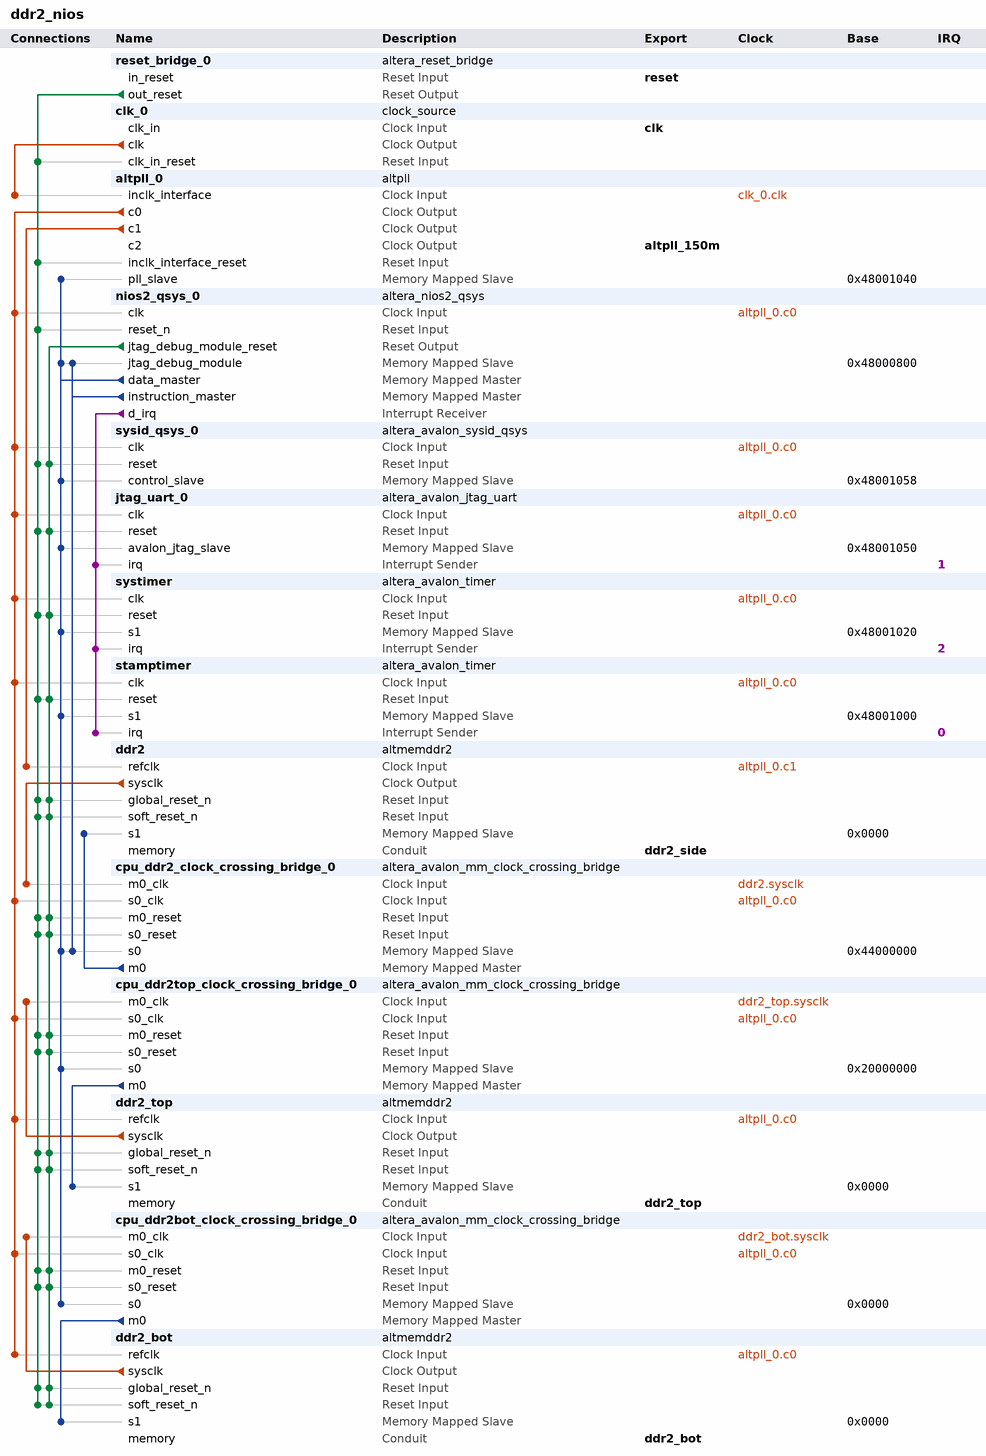
[diagram p0: system contents]
# Platform Designer (Qsys) system ddr2_nios, Cyclone IV E EP4CE115F29C8
# Parameters at their usual value, and those the tool derives, are not listed.
package require -exact qsys 13.0
create_system ddr2_nios
set_project_property DEVICE_FAMILY {Cyclone IV E}
set_project_property DEVICE EP4CE115F29C8

add_instance reset_bridge_0 altera_reset_bridge 13.0
set_instance_parameter_value reset_bridge_0 ACTIVE_LOW_RESET 1
set_instance_parameter_value reset_bridge_0 SYNCHRONOUS_EDGES none

add_instance clk_0 clock_source 13.0
set_instance_parameter_value clk_0 clockFrequency 50000000

add_instance altpll_0 altpll 13.0
set_instance_parameter_value altpll_0 INCLK0_INPUT_FREQUENCY 20000
set_instance_parameter_value altpll_0 CLK0_MULTIPLY_BY 2
set_instance_parameter_value altpll_0 CLK1_MULTIPLY_BY 8
set_instance_parameter_value altpll_0 CLK2_MULTIPLY_BY 3
set_instance_parameter_value altpll_0 CLK3_MULTIPLY_BY 1
set_instance_parameter_value altpll_0 CLK0_DIVIDE_BY 1
set_instance_parameter_value altpll_0 CLK1_DIVIDE_BY 5
set_instance_parameter_value altpll_0 CLK2_DIVIDE_BY 1
set_instance_parameter_value altpll_0 CLK3_DIVIDE_BY 1
set_instance_parameter_value altpll_0 CLK1_PHASE_SHIFT 0
set_instance_parameter_value altpll_0 CLK2_PHASE_SHIFT 0
set_instance_parameter_value altpll_0 CLK3_PHASE_SHIFT 0
set_instance_parameter_value altpll_0 CLK1_DUTY_CYCLE 50
set_instance_parameter_value altpll_0 CLK2_DUTY_CYCLE 50
set_instance_parameter_value altpll_0 CLK3_DUTY_CYCLE 50
set_instance_parameter_value altpll_0 PORT_clk1 PORT_USED
set_instance_parameter_value altpll_0 PORT_clk2 PORT_USED
set_instance_parameter_value altpll_0 PORT_clk3 PORT_USED
set_instance_parameter_value altpll_0 PORT_ARESET PORT_UNUSED
set_instance_parameter_value altpll_0 PORT_LOCKED PORT_UNUSED

add_instance nios2_qsys_0 altera_nios2_qsys 13.0
set_instance_parameter_value nios2_qsys_0 resetSlave ddr2.s1
set_instance_parameter_value nios2_qsys_0 mmu_TLBMissExcSlave None
set_instance_parameter_value nios2_qsys_0 exceptionSlave ddr2.s1
set_instance_parameter_value nios2_qsys_0 breakSlave nios2_qsys_0.jtag_debug_module
set_instance_parameter_value nios2_qsys_0 impl Fast
set_instance_parameter_value nios2_qsys_0 icache_size 8192
set_instance_parameter_value nios2_qsys_0 dcache_size 8192

add_instance sysid_qsys_0 altera_avalon_sysid_qsys 13.0
set_instance_parameter_value sysid_qsys_0 id 0

add_instance jtag_uart_0 altera_avalon_jtag_uart 13.0.1.99.2
set_instance_parameter_value jtag_uart_0 readBufferDepth 512
set_instance_parameter_value jtag_uart_0 simInteractiveOptions NO_INTERACTIVE_WINDOWS
set_instance_parameter_value jtag_uart_0 writeBufferDepth 512

add_instance systimer altera_avalon_timer 13.0.1.99.2
set_instance_parameter_value systimer period 10
set_instance_parameter_value systimer periodUnits MSEC

add_instance stamptimer altera_avalon_timer 13.0.1.99.2
set_instance_parameter_value stamptimer period 10
set_instance_parameter_value stamptimer periodUnits USEC

add_instance ddr2 altmemddr2 13.0
set_instance_parameter_value ddr2 pipeline_commands true
set_instance_parameter_value ddr2 debug_en false
set_instance_parameter_value ddr2 export_debug_port false
set_instance_parameter_value ddr2 use_generated_memory_model true
set_instance_parameter_value ddr2 dedicated_memory_clk_phase_label {Dedicated memory clock phase:}
set_instance_parameter_value ddr2 mem_if_clk_mhz 125.0
set_instance_parameter_value ddr2 quartus_project_exists false
set_instance_parameter_value ddr2 local_if_drate Full
set_instance_parameter_value ddr2 enable_v72_rsu false
set_instance_parameter_value ddr2 local_if_clk_mhz_label 125.0
set_instance_parameter_value ddr2 new_variant true
set_instance_parameter_value ddr2 mem_if_memtype {DDR2 SDRAM}
set_instance_parameter_value ddr2 pll_ref_clk_mhz 80.0
set_instance_parameter_value ddr2 mem_if_clk_ps_label {(8000 ps)}
set_instance_parameter_value ddr2 family {Cyclone IV E}
set_instance_parameter_value ddr2 project_family {Cyclone IV E}
set_instance_parameter_value ddr2 speed_grade 8
set_instance_parameter_value ddr2 dedicated_memory_clk_phase 0
set_instance_parameter_value ddr2 pll_ref_clk_ps_label {(12500 ps)}
set_instance_parameter_value ddr2 avalon_burst_length 1
set_instance_parameter_value ddr2 mem_if_clk_pair_count 1
set_instance_parameter_value ddr2 mem_if_cs_per_dimm 1
set_instance_parameter_value ddr2 pre_latency_label {Fix read latency at:}
set_instance_parameter_value ddr2 dedicated_memory_clk_en false
set_instance_parameter_value ddr2 mirror_addressing 0
set_instance_parameter_value ddr2 mem_if_bankaddr_width 2
set_instance_parameter_value ddr2 register_control_word_9 0000
set_instance_parameter_value ddr2 mem_if_rowaddr_width 13
set_instance_parameter_value ddr2 mem_dyn_deskew_en false
set_instance_parameter_value ddr2 post_latency_label {cycles (0 cycles=minimum latency, non-deterministic)}
set_instance_parameter_value ddr2 mem_if_dm_pins_en Yes
set_instance_parameter_value ddr2 local_if_dwidth_label 32
set_instance_parameter_value ddr2 register_control_word_7 0000
set_instance_parameter_value ddr2 register_control_word_8 0000
set_instance_parameter_value ddr2 mem_if_preset {Custom (Samsung K4T51163QB-GCCC)}
set_instance_parameter_value ddr2 mem_if_pchaddr_bit 10
set_instance_parameter_value ddr2 WIDTH_RATIO 4
set_instance_parameter_value ddr2 vendor Samsung
set_instance_parameter_value ddr2 register_control_word_3 0000
set_instance_parameter_value ddr2 register_control_word_4 0000
set_instance_parameter_value ddr2 chip_or_dimm {Discrete Device}
set_instance_parameter_value ddr2 register_control_word_5 0000
set_instance_parameter_value ddr2 register_control_word_6 0000
set_instance_parameter_value ddr2 mem_fmax 200.0
set_instance_parameter_value ddr2 register_control_word_0 0000
set_instance_parameter_value ddr2 register_control_word_size 4
set_instance_parameter_value ddr2 register_control_word_1 0000
set_instance_parameter_value ddr2 register_control_word_2 0000
set_instance_parameter_value ddr2 register_control_word_11 0000
set_instance_parameter_value ddr2 register_control_word_10 0000
set_instance_parameter_value ddr2 mem_if_cs_width 1
set_instance_parameter_value ddr2 mem_if_preset_rlat 0
set_instance_parameter_value ddr2 mem_if_cs_per_rank 1
set_instance_parameter_value ddr2 fast_simulation_en FAST
set_instance_parameter_value ddr2 register_control_word_15 0000
set_instance_parameter_value ddr2 register_control_word_14 0000
set_instance_parameter_value ddr2 mem_if_dwidth 16
set_instance_parameter_value ddr2 mem_if_dq_per_dqs 8
set_instance_parameter_value ddr2 mem_if_coladdr_width 10
set_instance_parameter_value ddr2 register_control_word_13 0000
set_instance_parameter_value ddr2 register_control_word_12 0000
set_instance_parameter_value ddr2 mem_tiha_ps 600
set_instance_parameter_value ddr2 mem_tdsh_ck 0.2
set_instance_parameter_value ddr2 mem_if_trfc_ns 105.0
set_instance_parameter_value ddr2 mem_tqh_ck 0.36
set_instance_parameter_value ddr2 mem_tisa_ps 600
set_instance_parameter_value ddr2 mem_tdss_ck 0.2
set_instance_parameter_value ddr2 mem_trtp_ns 8.8
set_instance_parameter_value ddr2 mem_if_tinit_us 200.0
set_instance_parameter_value ddr2 mem_if_trcd_ns 15.0
set_instance_parameter_value ddr2 mem_if_twtr_ck 2
set_instance_parameter_value ddr2 mem_trrd_ns 10.0
set_instance_parameter_value ddr2 mem_tdqss_ck 0.25
set_instance_parameter_value ddr2 mem_tqhs_ps 400
set_instance_parameter_value ddr2 mem_tdsa_ps 400
set_instance_parameter_value ddr2 mem_tac_ps 500
set_instance_parameter_value ddr2 mem_tdha_ps 400
set_instance_parameter_value ddr2 mem_if_tras_ns 45.0
set_instance_parameter_value ddr2 mem_if_twr_ns 15.0
set_instance_parameter_value ddr2 mem_tdqsck_ps 450
set_instance_parameter_value ddr2 mem_if_trp_ns 15.0
set_instance_parameter_value ddr2 mem_tdqsq_ps 300
set_instance_parameter_value ddr2 mem_if_tmrd_ns 7.0
set_instance_parameter_value ddr2 mem_tfaw_ns 50.0
set_instance_parameter_value ddr2 mem_if_trefi_us 7.0
set_instance_parameter_value ddr2 mem_tcl_40_fmax 200.0
set_instance_parameter_value ddr2 mem_odt 50
set_instance_parameter_value ddr2 mp_WLH_percent 0.6
set_instance_parameter_value ddr2 mem_drv_str Normal
set_instance_parameter_value ddr2 mp_DH_percent 0.5
set_instance_parameter_value ddr2 input_period 0
set_instance_parameter_value ddr2 mp_QH_percent 0.5
set_instance_parameter_value ddr2 mp_QHS_percent 0.5
set_instance_parameter_value ddr2 mem_tcl_30_fmax 200.0
set_instance_parameter_value ddr2 ac_clk_select 90
set_instance_parameter_value ddr2 mp_DQSQ_percent 0.65
set_instance_parameter_value ddr2 mp_DS_percent 0.6
set_instance_parameter_value ddr2 pll_reconfig_ports_en false
set_instance_parameter_value ddr2 mem_btype Sequential
set_instance_parameter_value ddr2 mp_IS_percent 0.7
set_instance_parameter_value ddr2 mem_tcl 3.0
set_instance_parameter_value ddr2 mp_DQSS_percent 0.5
set_instance_parameter_value ddr2 export_bank_info false
set_instance_parameter_value ddr2 mp_DSS_percent 0.6
set_instance_parameter_value ddr2 mem_dll_en Yes
set_instance_parameter_value ddr2 ac_phase 90
set_instance_parameter_value ddr2 mem_if_oct_en false
set_instance_parameter_value ddr2 mem_tcl_60_fmax 200.0
set_instance_parameter_value ddr2 mp_DSH_percent 0.6
set_instance_parameter_value ddr2 mem_if_dqsn_en false
set_instance_parameter_value ddr2 enable_mp_calibration true
set_instance_parameter_value ddr2 mp_IH_percent 0.6
set_instance_parameter_value ddr2 mem_tcl_15_fmax 533.0
set_instance_parameter_value ddr2 dll_external false
set_instance_parameter_value ddr2 mem_bl 4
set_instance_parameter_value ddr2 mp_WLS_percent 0.7
set_instance_parameter_value ddr2 mem_tcl_50_fmax 200.0
set_instance_parameter_value ddr2 mp_DQSCK_percent 0.5
set_instance_parameter_value ddr2 mem_tcl_25_fmax 533.0
set_instance_parameter_value ddr2 mem_tcl_20_fmax 533.0
set_instance_parameter_value ddr2 cfg_reorder_data true
set_instance_parameter_value ddr2 ctl_ecc_en false
set_instance_parameter_value ddr2 ctl_hrb_en false
set_instance_parameter_value ddr2 ref_clk_source altpll_0
set_instance_parameter_value ddr2 cfg_data_reordering_type INTER_BANK
set_instance_parameter_value ddr2 ctl_powerdn_en false
set_instance_parameter_value ddr2 multicast_wr_en false
set_instance_parameter_value ddr2 auto_powerdn_cycles 0
set_instance_parameter_value ddr2 ctl_self_refresh_en false
set_instance_parameter_value ddr2 cfg_starve_limit 10
set_instance_parameter_value ddr2 ctl_latency 0
set_instance_parameter_value ddr2 tool_context SOPC_BUILDER
set_instance_parameter_value ddr2 mem_addr_mapping CHIP_ROW_BANK_COL
set_instance_parameter_value ddr2 burst_merge_en false
set_instance_parameter_value ddr2 user_refresh_en false
set_instance_parameter_value ddr2 qsys_mode true
set_instance_parameter_value ddr2 clk_source_sharing_en false
set_instance_parameter_value ddr2 ctl_lookahead_depth 4
set_instance_parameter_value ddr2 ctl_autopch_en false
set_instance_parameter_value ddr2 ctl_dynamic_bank_allocation false
set_instance_parameter_value ddr2 ctl_dynamic_bank_num 4
set_instance_parameter_value ddr2 local_if_type_avalon true
set_instance_parameter_value ddr2 csr_en false
set_instance_parameter_value ddr2 ctl_auto_correct_en false
set_instance_parameter_value ddr2 auto_powerdn_en false
set_instance_parameter_value ddr2 phy_if_type_afi true
set_instance_parameter_value ddr2 controller_type ngv110_ctl
set_instance_parameter_value ddr2 max_local_size 4
set_instance_parameter_value ddr2 mem_srtr Normal
set_instance_parameter_value ddr2 mem_mpr_loc {Predefined Pattern}
set_instance_parameter_value ddr2 dss_tinit_rst_us 200.0
set_instance_parameter_value ddr2 mem_tcl_90_fmax 400.0
set_instance_parameter_value ddr2 mem_rtt_wr {Dynamic ODT off}
set_instance_parameter_value ddr2 mem_tcl_100_fmax 400.0
set_instance_parameter_value ddr2 mem_pasr {Full Array}
set_instance_parameter_value ddr2 mem_asrm {Manual SR Reference (SRT)}
set_instance_parameter_value ddr2 mem_mpr_oper {Predefined Pattern}
set_instance_parameter_value ddr2 mem_tcl_80_fmax 400.0
set_instance_parameter_value ddr2 mem_drv_impedance RZQ/7
set_instance_parameter_value ddr2 mem_rtt_nom {ODT Disabled}
set_instance_parameter_value ddr2 mem_tcl_70_fmax 400.0
set_instance_parameter_value ddr2 mem_wtcl 5.0
set_instance_parameter_value ddr2 mem_dll_pch {Fast Exit}
set_instance_parameter_value ddr2 mem_atcl Disabled
set_instance_parameter_value ddr2 board_settings_valid true
set_instance_parameter_value ddr2 t_IH 0.6
set_instance_parameter_value ddr2 board_intra_DQS_group_skew 0.02
set_instance_parameter_value ddr2 isi_DQS 0.0
set_instance_parameter_value ddr2 addr_cmd_slew_rate 1.0
set_instance_parameter_value ddr2 board_tpd_inter_DIMM 0.05
set_instance_parameter_value ddr2 board_addresscmd_CK_skew 0.0
set_instance_parameter_value ddr2 t_DS_calculated 0.400
set_instance_parameter_value ddr2 isi_addresscmd_hold 0.0
set_instance_parameter_value ddr2 t_IS 0.6
set_instance_parameter_value ddr2 restore_default_toggle false
set_instance_parameter_value ddr2 dqs_dqsn_slew_rate 2.0
set_instance_parameter_value ddr2 dq_slew_rate 1.0
set_instance_parameter_value ddr2 board_inter_DQS_group_skew 0.02
set_instance_parameter_value ddr2 isi_addresscmd_setup 0.0
set_instance_parameter_value ddr2 board_minCK_DQS_skew -0.01
set_instance_parameter_value ddr2 t_IS_calculated 0.600
set_instance_parameter_value ddr2 num_slots_or_devices 1
set_instance_parameter_value ddr2 board_maxCK_DQS_skew 0.01
set_instance_parameter_value ddr2 board_skew_ps 20
set_instance_parameter_value ddr2 t_DH 0.4
set_instance_parameter_value ddr2 ck_ckn_slew_rate 2.0
set_instance_parameter_value ddr2 isi_DQ 0.0
set_instance_parameter_value ddr2 t_IH_calculated 0.600
set_instance_parameter_value ddr2 t_DH_calculated 0.400
set_instance_parameter_value ddr2 t_DS 0.4

add_instance cpu_ddr2_clock_crossing_bridge_0 altera_avalon_mm_clock_crossing_bridge 13.0
set_instance_parameter_value cpu_ddr2_clock_crossing_bridge_0 DATA_WIDTH 32
set_instance_parameter_value cpu_ddr2_clock_crossing_bridge_0 ADDRESS_WIDTH 26
set_instance_parameter_value cpu_ddr2_clock_crossing_bridge_0 MAX_BURST_SIZE 2
set_instance_parameter_value cpu_ddr2_clock_crossing_bridge_0 COMMAND_FIFO_DEPTH 128
set_instance_parameter_value cpu_ddr2_clock_crossing_bridge_0 RESPONSE_FIFO_DEPTH 128
set_instance_parameter_value cpu_ddr2_clock_crossing_bridge_0 MASTER_SYNC_DEPTH 2
set_instance_parameter_value cpu_ddr2_clock_crossing_bridge_0 SLAVE_SYNC_DEPTH 2

add_instance cpu_ddr2top_clock_crossing_bridge_0 altera_avalon_mm_clock_crossing_bridge 13.0
set_instance_parameter_value cpu_ddr2top_clock_crossing_bridge_0 DATA_WIDTH 96
set_instance_parameter_value cpu_ddr2top_clock_crossing_bridge_0 ADDRESS_WIDTH 28
set_instance_parameter_value cpu_ddr2top_clock_crossing_bridge_0 MAX_BURST_SIZE 4
set_instance_parameter_value cpu_ddr2top_clock_crossing_bridge_0 COMMAND_FIFO_DEPTH 128
set_instance_parameter_value cpu_ddr2top_clock_crossing_bridge_0 RESPONSE_FIFO_DEPTH 128
set_instance_parameter_value cpu_ddr2top_clock_crossing_bridge_0 MASTER_SYNC_DEPTH 2
set_instance_parameter_value cpu_ddr2top_clock_crossing_bridge_0 SLAVE_SYNC_DEPTH 2

add_instance ddr2_top altmemddr2 13.0
set_instance_parameter_value ddr2_top pipeline_commands false
set_instance_parameter_value ddr2_top debug_en false
set_instance_parameter_value ddr2_top export_debug_port false
set_instance_parameter_value ddr2_top use_generated_memory_model true
set_instance_parameter_value ddr2_top dedicated_memory_clk_phase_label {Dedicated memory clock phase:}
set_instance_parameter_value ddr2_top mem_if_clk_mhz 150.0
set_instance_parameter_value ddr2_top quartus_project_exists false
set_instance_parameter_value ddr2_top local_if_drate Full
set_instance_parameter_value ddr2_top enable_v72_rsu false
set_instance_parameter_value ddr2_top local_if_clk_mhz_label 150.0
set_instance_parameter_value ddr2_top new_variant true
set_instance_parameter_value ddr2_top mem_if_memtype {DDR2 SDRAM}
set_instance_parameter_value ddr2_top pll_ref_clk_mhz 100.0
set_instance_parameter_value ddr2_top mem_if_clk_ps_label {(6667 ps)}
set_instance_parameter_value ddr2_top family {Cyclone IV E}
set_instance_parameter_value ddr2_top project_family {Cyclone IV E}
set_instance_parameter_value ddr2_top speed_grade 8
set_instance_parameter_value ddr2_top dedicated_memory_clk_phase 0
set_instance_parameter_value ddr2_top pll_ref_clk_ps_label {(10000 ps)}
set_instance_parameter_value ddr2_top avalon_burst_length 1
set_instance_parameter_value ddr2_top mem_if_clk_pair_count 2
set_instance_parameter_value ddr2_top mem_if_cs_per_dimm 1
set_instance_parameter_value ddr2_top pre_latency_label {Fix read latency at:}
set_instance_parameter_value ddr2_top dedicated_memory_clk_en false
set_instance_parameter_value ddr2_top mirror_addressing 0
set_instance_parameter_value ddr2_top mem_if_bankaddr_width 2
set_instance_parameter_value ddr2_top register_control_word_9 0000
set_instance_parameter_value ddr2_top mem_if_rowaddr_width 13
set_instance_parameter_value ddr2_top mem_dyn_deskew_en false
set_instance_parameter_value ddr2_top post_latency_label {cycles (0 cycles=minimum latency, non-deterministic)}
set_instance_parameter_value ddr2_top mem_if_dm_pins_en Yes
set_instance_parameter_value ddr2_top local_if_dwidth_label 96
set_instance_parameter_value ddr2_top register_control_word_7 0000
set_instance_parameter_value ddr2_top register_control_word_8 0000
set_instance_parameter_value ddr2_top mem_if_preset {Micron MT47H32M16CC-3}
set_instance_parameter_value ddr2_top mem_if_pchaddr_bit 10
set_instance_parameter_value ddr2_top WIDTH_RATIO 4
set_instance_parameter_value ddr2_top vendor Micron
set_instance_parameter_value ddr2_top register_control_word_3 0000
set_instance_parameter_value ddr2_top register_control_word_4 0000
set_instance_parameter_value ddr2_top chip_or_dimm {Discrete Device}
set_instance_parameter_value ddr2_top register_control_word_5 0000
set_instance_parameter_value ddr2_top register_control_word_6 0000
set_instance_parameter_value ddr2_top mem_fmax 333.333
set_instance_parameter_value ddr2_top register_control_word_0 0000
set_instance_parameter_value ddr2_top register_control_word_size 4
set_instance_parameter_value ddr2_top register_control_word_1 0000
set_instance_parameter_value ddr2_top register_control_word_2 0000
set_instance_parameter_value ddr2_top register_control_word_11 0000
set_instance_parameter_value ddr2_top register_control_word_10 0000
set_instance_parameter_value ddr2_top mem_if_cs_width 1
set_instance_parameter_value ddr2_top mem_if_preset_rlat 0
set_instance_parameter_value ddr2_top mem_if_cs_per_rank 1
set_instance_parameter_value ddr2_top fast_simulation_en FAST
set_instance_parameter_value ddr2_top register_control_word_15 0000
set_instance_parameter_value ddr2_top register_control_word_14 0000
set_instance_parameter_value ddr2_top mem_if_dwidth 48
set_instance_parameter_value ddr2_top mem_if_dq_per_dqs 8
set_instance_parameter_value ddr2_top mem_if_coladdr_width 10
set_instance_parameter_value ddr2_top register_control_word_13 0000
set_instance_parameter_value ddr2_top register_control_word_12 0000
set_instance_parameter_value ddr2_top mem_tiha_ps 400
set_instance_parameter_value ddr2_top mem_tdsh_ck 0.2
set_instance_parameter_value ddr2_top mem_if_trfc_ns 105.0
set_instance_parameter_value ddr2_top mem_tqh_ck 0.36
set_instance_parameter_value ddr2_top mem_tisa_ps 400
set_instance_parameter_value ddr2_top mem_tdss_ck 0.2
set_instance_parameter_value ddr2_top mem_trtp_ns 7.5
set_instance_parameter_value ddr2_top mem_if_tinit_us 200.0
set_instance_parameter_value ddr2_top mem_if_trcd_ns 15.0
set_instance_parameter_value ddr2_top mem_if_twtr_ck 3
set_instance_parameter_value ddr2_top mem_trrd_ns 10.0
set_instance_parameter_value ddr2_top mem_tdqss_ck 0.25
set_instance_parameter_value ddr2_top mem_tqhs_ps 340
set_instance_parameter_value ddr2_top mem_tdsa_ps 300
set_instance_parameter_value ddr2_top mem_tac_ps 450
set_instance_parameter_value ddr2_top mem_tdha_ps 300
set_instance_parameter_value ddr2_top mem_if_tras_ns 40.0
set_instance_parameter_value ddr2_top mem_if_twr_ns 15.0
set_instance_parameter_value ddr2_top mem_tdqsck_ps 400
set_instance_parameter_value ddr2_top mem_if_trp_ns 15.0
set_instance_parameter_value ddr2_top mem_tdqsq_ps 240
set_instance_parameter_value ddr2_top mem_if_tmrd_ns 6.0
set_instance_parameter_value ddr2_top mem_tfaw_ns 50.0
set_instance_parameter_value ddr2_top mem_if_trefi_us 7.8
set_instance_parameter_value ddr2_top mem_tcl_40_fmax 266.667
set_instance_parameter_value ddr2_top mem_odt 50
set_instance_parameter_value ddr2_top mp_WLH_percent 0.6
set_instance_parameter_value ddr2_top mem_drv_str Normal
set_instance_parameter_value ddr2_top mp_DH_percent 0.5
set_instance_parameter_value ddr2_top input_period 0
set_instance_parameter_value ddr2_top mp_QH_percent 0.5
set_instance_parameter_value ddr2_top mp_QHS_percent 0.5
set_instance_parameter_value ddr2_top mem_tcl_30_fmax 200.0
set_instance_parameter_value ddr2_top ac_clk_select 90
set_instance_parameter_value ddr2_top mp_DQSQ_percent 0.65
set_instance_parameter_value ddr2_top mp_DS_percent 0.6
set_instance_parameter_value ddr2_top pll_reconfig_ports_en false
set_instance_parameter_value ddr2_top mem_btype Sequential
set_instance_parameter_value ddr2_top mp_IS_percent 0.7
set_instance_parameter_value ddr2_top mem_tcl 5.0
set_instance_parameter_value ddr2_top mp_DQSS_percent 0.5
set_instance_parameter_value ddr2_top export_bank_info false
set_instance_parameter_value ddr2_top mp_DSS_percent 0.6
set_instance_parameter_value ddr2_top mem_dll_en Yes
set_instance_parameter_value ddr2_top ac_phase 90
set_instance_parameter_value ddr2_top mem_if_oct_en false
set_instance_parameter_value ddr2_top mem_tcl_60_fmax 333.333
set_instance_parameter_value ddr2_top mp_DSH_percent 0.6
set_instance_parameter_value ddr2_top mem_if_dqsn_en false
set_instance_parameter_value ddr2_top enable_mp_calibration true
set_instance_parameter_value ddr2_top mp_IH_percent 0.6
set_instance_parameter_value ddr2_top mem_tcl_15_fmax 533.0
set_instance_parameter_value ddr2_top dll_external false
set_instance_parameter_value ddr2_top mem_bl 4
set_instance_parameter_value ddr2_top mp_WLS_percent 0.7
set_instance_parameter_value ddr2_top mem_tcl_50_fmax 333.333
set_instance_parameter_value ddr2_top mp_DQSCK_percent 0.5
set_instance_parameter_value ddr2_top mem_tcl_25_fmax 533.0
set_instance_parameter_value ddr2_top mem_tcl_20_fmax 533.0
set_instance_parameter_value ddr2_top cfg_reorder_data true
set_instance_parameter_value ddr2_top ctl_ecc_en false
set_instance_parameter_value ddr2_top ctl_hrb_en false
set_instance_parameter_value ddr2_top ref_clk_source altpll_0
set_instance_parameter_value ddr2_top cfg_data_reordering_type INTER_BANK
set_instance_parameter_value ddr2_top ctl_powerdn_en false
set_instance_parameter_value ddr2_top multicast_wr_en false
set_instance_parameter_value ddr2_top auto_powerdn_cycles 0
set_instance_parameter_value ddr2_top ctl_self_refresh_en false
set_instance_parameter_value ddr2_top cfg_starve_limit 10
set_instance_parameter_value ddr2_top ctl_latency 0
set_instance_parameter_value ddr2_top tool_context SOPC_BUILDER
set_instance_parameter_value ddr2_top mem_addr_mapping CHIP_ROW_BANK_COL
set_instance_parameter_value ddr2_top burst_merge_en false
set_instance_parameter_value ddr2_top user_refresh_en false
set_instance_parameter_value ddr2_top qsys_mode true
set_instance_parameter_value ddr2_top clk_source_sharing_en false
set_instance_parameter_value ddr2_top ctl_lookahead_depth 4
set_instance_parameter_value ddr2_top ctl_autopch_en false
set_instance_parameter_value ddr2_top ctl_dynamic_bank_allocation false
set_instance_parameter_value ddr2_top ctl_dynamic_bank_num 4
set_instance_parameter_value ddr2_top local_if_type_avalon true
set_instance_parameter_value ddr2_top csr_en false
set_instance_parameter_value ddr2_top ctl_auto_correct_en false
set_instance_parameter_value ddr2_top auto_powerdn_en false
set_instance_parameter_value ddr2_top phy_if_type_afi true
set_instance_parameter_value ddr2_top controller_type ngv110_ctl
set_instance_parameter_value ddr2_top max_local_size 4
set_instance_parameter_value ddr2_top mem_srtr Normal
set_instance_parameter_value ddr2_top mem_mpr_loc {Predefined Pattern}
set_instance_parameter_value ddr2_top dss_tinit_rst_us 200.0
set_instance_parameter_value ddr2_top mem_tcl_90_fmax 400.0
set_instance_parameter_value ddr2_top mem_rtt_wr {Dynamic ODT off}
set_instance_parameter_value ddr2_top mem_tcl_100_fmax 400.0
set_instance_parameter_value ddr2_top mem_pasr {Full Array}
set_instance_parameter_value ddr2_top mem_asrm {Manual SR Reference (SRT)}
set_instance_parameter_value ddr2_top mem_mpr_oper {Predefined Pattern}
set_instance_parameter_value ddr2_top mem_tcl_80_fmax 400.0
set_instance_parameter_value ddr2_top mem_drv_impedance RZQ/7
set_instance_parameter_value ddr2_top mem_rtt_nom {ODT Disabled}
set_instance_parameter_value ddr2_top mem_tcl_70_fmax 400.0
set_instance_parameter_value ddr2_top mem_wtcl 5.0
set_instance_parameter_value ddr2_top mem_dll_pch {Fast Exit}
set_instance_parameter_value ddr2_top mem_atcl Disabled
set_instance_parameter_value ddr2_top board_settings_valid true
set_instance_parameter_value ddr2_top t_IH 0.4
set_instance_parameter_value ddr2_top board_intra_DQS_group_skew 0.02
set_instance_parameter_value ddr2_top isi_DQS 0.0
set_instance_parameter_value ddr2_top addr_cmd_slew_rate 1.0
set_instance_parameter_value ddr2_top board_tpd_inter_DIMM 0.05
set_instance_parameter_value ddr2_top board_addresscmd_CK_skew 0.0
set_instance_parameter_value ddr2_top t_DS_calculated 0.300
set_instance_parameter_value ddr2_top isi_addresscmd_hold 0.0
set_instance_parameter_value ddr2_top t_IS 0.4
set_instance_parameter_value ddr2_top restore_default_toggle false
set_instance_parameter_value ddr2_top dqs_dqsn_slew_rate 2.0
set_instance_parameter_value ddr2_top dq_slew_rate 1.0
set_instance_parameter_value ddr2_top board_inter_DQS_group_skew 0.02
set_instance_parameter_value ddr2_top isi_addresscmd_setup 0.0
set_instance_parameter_value ddr2_top board_minCK_DQS_skew -0.01
set_instance_parameter_value ddr2_top t_IS_calculated 0.400
set_instance_parameter_value ddr2_top num_slots_or_devices 1
set_instance_parameter_value ddr2_top board_maxCK_DQS_skew 0.01
set_instance_parameter_value ddr2_top board_skew_ps 20
set_instance_parameter_value ddr2_top t_DH 0.3
set_instance_parameter_value ddr2_top ck_ckn_slew_rate 2.0
set_instance_parameter_value ddr2_top isi_DQ 0.0
set_instance_parameter_value ddr2_top t_IH_calculated 0.400
set_instance_parameter_value ddr2_top t_DH_calculated 0.300
set_instance_parameter_value ddr2_top t_DS 0.3

add_instance cpu_ddr2bot_clock_crossing_bridge_0 altera_avalon_mm_clock_crossing_bridge 13.0
set_instance_parameter_value cpu_ddr2bot_clock_crossing_bridge_0 DATA_WIDTH 96
set_instance_parameter_value cpu_ddr2bot_clock_crossing_bridge_0 ADDRESS_WIDTH 28
set_instance_parameter_value cpu_ddr2bot_clock_crossing_bridge_0 MAX_BURST_SIZE 4
set_instance_parameter_value cpu_ddr2bot_clock_crossing_bridge_0 COMMAND_FIFO_DEPTH 128
set_instance_parameter_value cpu_ddr2bot_clock_crossing_bridge_0 RESPONSE_FIFO_DEPTH 128
set_instance_parameter_value cpu_ddr2bot_clock_crossing_bridge_0 MASTER_SYNC_DEPTH 2
set_instance_parameter_value cpu_ddr2bot_clock_crossing_bridge_0 SLAVE_SYNC_DEPTH 2

add_instance ddr2_bot altmemddr2 13.0
set_instance_parameter_value ddr2_bot pipeline_commands false
set_instance_parameter_value ddr2_bot debug_en false
set_instance_parameter_value ddr2_bot export_debug_port false
set_instance_parameter_value ddr2_bot use_generated_memory_model true
set_instance_parameter_value ddr2_bot dedicated_memory_clk_phase_label {Dedicated memory clock phase:}
set_instance_parameter_value ddr2_bot mem_if_clk_mhz 150.0
set_instance_parameter_value ddr2_bot quartus_project_exists false
set_instance_parameter_value ddr2_bot local_if_drate Full
set_instance_parameter_value ddr2_bot enable_v72_rsu false
set_instance_parameter_value ddr2_bot local_if_clk_mhz_label 150.0
set_instance_parameter_value ddr2_bot new_variant true
set_instance_parameter_value ddr2_bot mem_if_memtype {DDR2 SDRAM}
set_instance_parameter_value ddr2_bot pll_ref_clk_mhz 100.0
set_instance_parameter_value ddr2_bot mem_if_clk_ps_label {(6667 ps)}
set_instance_parameter_value ddr2_bot family {Cyclone IV E}
set_instance_parameter_value ddr2_bot project_family {Cyclone IV E}
set_instance_parameter_value ddr2_bot speed_grade 8
set_instance_parameter_value ddr2_bot dedicated_memory_clk_phase 0
set_instance_parameter_value ddr2_bot pll_ref_clk_ps_label {(10000 ps)}
set_instance_parameter_value ddr2_bot avalon_burst_length 1
set_instance_parameter_value ddr2_bot mem_if_clk_pair_count 2
set_instance_parameter_value ddr2_bot mem_if_cs_per_dimm 1
set_instance_parameter_value ddr2_bot pre_latency_label {Fix read latency at:}
set_instance_parameter_value ddr2_bot dedicated_memory_clk_en false
set_instance_parameter_value ddr2_bot mirror_addressing 0
set_instance_parameter_value ddr2_bot mem_if_bankaddr_width 2
set_instance_parameter_value ddr2_bot register_control_word_9 0000
set_instance_parameter_value ddr2_bot mem_if_rowaddr_width 13
set_instance_parameter_value ddr2_bot mem_dyn_deskew_en false
set_instance_parameter_value ddr2_bot post_latency_label {cycles (0 cycles=minimum latency, non-deterministic)}
set_instance_parameter_value ddr2_bot mem_if_dm_pins_en Yes
set_instance_parameter_value ddr2_bot local_if_dwidth_label 96
set_instance_parameter_value ddr2_bot register_control_word_7 0000
set_instance_parameter_value ddr2_bot register_control_word_8 0000
set_instance_parameter_value ddr2_bot mem_if_preset {Micron MT47H32M16CC-3}
set_instance_parameter_value ddr2_bot mem_if_pchaddr_bit 10
set_instance_parameter_value ddr2_bot WIDTH_RATIO 4
set_instance_parameter_value ddr2_bot vendor Micron
set_instance_parameter_value ddr2_bot register_control_word_3 0000
set_instance_parameter_value ddr2_bot register_control_word_4 0000
set_instance_parameter_value ddr2_bot chip_or_dimm {Discrete Device}
set_instance_parameter_value ddr2_bot register_control_word_5 0000
set_instance_parameter_value ddr2_bot register_control_word_6 0000
set_instance_parameter_value ddr2_bot mem_fmax 333.333
set_instance_parameter_value ddr2_bot register_control_word_0 0000
set_instance_parameter_value ddr2_bot register_control_word_size 4
set_instance_parameter_value ddr2_bot register_control_word_1 0000
set_instance_parameter_value ddr2_bot register_control_word_2 0000
set_instance_parameter_value ddr2_bot register_control_word_11 0000
set_instance_parameter_value ddr2_bot register_control_word_10 0000
set_instance_parameter_value ddr2_bot mem_if_cs_width 1
set_instance_parameter_value ddr2_bot mem_if_preset_rlat 0
set_instance_parameter_value ddr2_bot mem_if_cs_per_rank 1
set_instance_parameter_value ddr2_bot fast_simulation_en FAST
set_instance_parameter_value ddr2_bot register_control_word_15 0000
set_instance_parameter_value ddr2_bot register_control_word_14 0000
set_instance_parameter_value ddr2_bot mem_if_dwidth 48
set_instance_parameter_value ddr2_bot mem_if_dq_per_dqs 8
set_instance_parameter_value ddr2_bot mem_if_coladdr_width 10
set_instance_parameter_value ddr2_bot register_control_word_13 0000
set_instance_parameter_value ddr2_bot register_control_word_12 0000
set_instance_parameter_value ddr2_bot mem_tiha_ps 400
set_instance_parameter_value ddr2_bot mem_tdsh_ck 0.2
set_instance_parameter_value ddr2_bot mem_if_trfc_ns 105.0
set_instance_parameter_value ddr2_bot mem_tqh_ck 0.36
set_instance_parameter_value ddr2_bot mem_tisa_ps 400
set_instance_parameter_value ddr2_bot mem_tdss_ck 0.2
set_instance_parameter_value ddr2_bot mem_trtp_ns 7.5
set_instance_parameter_value ddr2_bot mem_if_tinit_us 200.0
set_instance_parameter_value ddr2_bot mem_if_trcd_ns 15.0
set_instance_parameter_value ddr2_bot mem_if_twtr_ck 3
set_instance_parameter_value ddr2_bot mem_trrd_ns 10.0
set_instance_parameter_value ddr2_bot mem_tdqss_ck 0.25
set_instance_parameter_value ddr2_bot mem_tqhs_ps 340
set_instance_parameter_value ddr2_bot mem_tdsa_ps 300
set_instance_parameter_value ddr2_bot mem_tac_ps 450
set_instance_parameter_value ddr2_bot mem_tdha_ps 300
set_instance_parameter_value ddr2_bot mem_if_tras_ns 40.0
set_instance_parameter_value ddr2_bot mem_if_twr_ns 15.0
set_instance_parameter_value ddr2_bot mem_tdqsck_ps 400
set_instance_parameter_value ddr2_bot mem_if_trp_ns 15.0
set_instance_parameter_value ddr2_bot mem_tdqsq_ps 240
set_instance_parameter_value ddr2_bot mem_if_tmrd_ns 6.0
set_instance_parameter_value ddr2_bot mem_tfaw_ns 50.0
set_instance_parameter_value ddr2_bot mem_if_trefi_us 7.8
set_instance_parameter_value ddr2_bot mem_tcl_40_fmax 266.667
set_instance_parameter_value ddr2_bot mem_odt 50
set_instance_parameter_value ddr2_bot mp_WLH_percent 0.6
set_instance_parameter_value ddr2_bot mem_drv_str Normal
set_instance_parameter_value ddr2_bot mp_DH_percent 0.5
set_instance_parameter_value ddr2_bot input_period 0
set_instance_parameter_value ddr2_bot mp_QH_percent 0.5
set_instance_parameter_value ddr2_bot mp_QHS_percent 0.5
set_instance_parameter_value ddr2_bot mem_tcl_30_fmax 200.0
set_instance_parameter_value ddr2_bot ac_clk_select 90
set_instance_parameter_value ddr2_bot mp_DQSQ_percent 0.65
set_instance_parameter_value ddr2_bot mp_DS_percent 0.6
set_instance_parameter_value ddr2_bot pll_reconfig_ports_en false
set_instance_parameter_value ddr2_bot mem_btype Sequential
set_instance_parameter_value ddr2_bot mp_IS_percent 0.7
set_instance_parameter_value ddr2_bot mem_tcl 5.0
set_instance_parameter_value ddr2_bot mp_DQSS_percent 0.5
set_instance_parameter_value ddr2_bot export_bank_info false
set_instance_parameter_value ddr2_bot mp_DSS_percent 0.6
set_instance_parameter_value ddr2_bot mem_dll_en Yes
set_instance_parameter_value ddr2_bot ac_phase 90
set_instance_parameter_value ddr2_bot mem_if_oct_en false
set_instance_parameter_value ddr2_bot mem_tcl_60_fmax 333.333
set_instance_parameter_value ddr2_bot mp_DSH_percent 0.6
set_instance_parameter_value ddr2_bot mem_if_dqsn_en false
set_instance_parameter_value ddr2_bot enable_mp_calibration true
set_instance_parameter_value ddr2_bot mp_IH_percent 0.6
set_instance_parameter_value ddr2_bot mem_tcl_15_fmax 533.0
set_instance_parameter_value ddr2_bot dll_external false
set_instance_parameter_value ddr2_bot mem_bl 4
set_instance_parameter_value ddr2_bot mp_WLS_percent 0.7
set_instance_parameter_value ddr2_bot mem_tcl_50_fmax 333.333
set_instance_parameter_value ddr2_bot mp_DQSCK_percent 0.5
set_instance_parameter_value ddr2_bot mem_tcl_25_fmax 533.0
set_instance_parameter_value ddr2_bot mem_tcl_20_fmax 533.0
set_instance_parameter_value ddr2_bot cfg_reorder_data true
set_instance_parameter_value ddr2_bot ctl_ecc_en false
set_instance_parameter_value ddr2_bot ctl_hrb_en false
set_instance_parameter_value ddr2_bot ref_clk_source altpll_0
set_instance_parameter_value ddr2_bot cfg_data_reordering_type INTER_BANK
set_instance_parameter_value ddr2_bot ctl_powerdn_en false
set_instance_parameter_value ddr2_bot multicast_wr_en false
set_instance_parameter_value ddr2_bot auto_powerdn_cycles 0
set_instance_parameter_value ddr2_bot ctl_self_refresh_en false
set_instance_parameter_value ddr2_bot cfg_starve_limit 10
set_instance_parameter_value ddr2_bot ctl_latency 0
set_instance_parameter_value ddr2_bot tool_context SOPC_BUILDER
set_instance_parameter_value ddr2_bot mem_addr_mapping CHIP_ROW_BANK_COL
set_instance_parameter_value ddr2_bot burst_merge_en false
set_instance_parameter_value ddr2_bot user_refresh_en false
set_instance_parameter_value ddr2_bot qsys_mode true
set_instance_parameter_value ddr2_bot clk_source_sharing_en false
set_instance_parameter_value ddr2_bot ctl_lookahead_depth 4
set_instance_parameter_value ddr2_bot ctl_autopch_en false
set_instance_parameter_value ddr2_bot ctl_dynamic_bank_allocation false
set_instance_parameter_value ddr2_bot ctl_dynamic_bank_num 4
set_instance_parameter_value ddr2_bot local_if_type_avalon true
set_instance_parameter_value ddr2_bot csr_en false
set_instance_parameter_value ddr2_bot ctl_auto_correct_en false
set_instance_parameter_value ddr2_bot auto_powerdn_en false
set_instance_parameter_value ddr2_bot phy_if_type_afi true
set_instance_parameter_value ddr2_bot controller_type ngv110_ctl
set_instance_parameter_value ddr2_bot max_local_size 4
set_instance_parameter_value ddr2_bot mem_srtr Normal
set_instance_parameter_value ddr2_bot mem_mpr_loc {Predefined Pattern}
set_instance_parameter_value ddr2_bot dss_tinit_rst_us 200.0
set_instance_parameter_value ddr2_bot mem_tcl_90_fmax 400.0
set_instance_parameter_value ddr2_bot mem_rtt_wr {Dynamic ODT off}
set_instance_parameter_value ddr2_bot mem_tcl_100_fmax 400.0
set_instance_parameter_value ddr2_bot mem_pasr {Full Array}
set_instance_parameter_value ddr2_bot mem_asrm {Manual SR Reference (SRT)}
set_instance_parameter_value ddr2_bot mem_mpr_oper {Predefined Pattern}
set_instance_parameter_value ddr2_bot mem_tcl_80_fmax 400.0
set_instance_parameter_value ddr2_bot mem_drv_impedance RZQ/7
set_instance_parameter_value ddr2_bot mem_rtt_nom {ODT Disabled}
set_instance_parameter_value ddr2_bot mem_tcl_70_fmax 400.0
set_instance_parameter_value ddr2_bot mem_wtcl 5.0
set_instance_parameter_value ddr2_bot mem_dll_pch {Fast Exit}
set_instance_parameter_value ddr2_bot mem_atcl Disabled
set_instance_parameter_value ddr2_bot board_settings_valid true
set_instance_parameter_value ddr2_bot t_IH 0.4
set_instance_parameter_value ddr2_bot board_intra_DQS_group_skew 0.02
set_instance_parameter_value ddr2_bot isi_DQS 0.0
set_instance_parameter_value ddr2_bot addr_cmd_slew_rate 1.0
set_instance_parameter_value ddr2_bot board_tpd_inter_DIMM 0.05
set_instance_parameter_value ddr2_bot board_addresscmd_CK_skew 0.0
set_instance_parameter_value ddr2_bot t_DS_calculated 0.300
set_instance_parameter_value ddr2_bot isi_addresscmd_hold 0.0
set_instance_parameter_value ddr2_bot t_IS 0.4
set_instance_parameter_value ddr2_bot restore_default_toggle false
set_instance_parameter_value ddr2_bot dqs_dqsn_slew_rate 2.0
set_instance_parameter_value ddr2_bot dq_slew_rate 1.0
set_instance_parameter_value ddr2_bot board_inter_DQS_group_skew 0.02
set_instance_parameter_value ddr2_bot isi_addresscmd_setup 0.0
set_instance_parameter_value ddr2_bot board_minCK_DQS_skew -0.01
set_instance_parameter_value ddr2_bot t_IS_calculated 0.400
set_instance_parameter_value ddr2_bot num_slots_or_devices 1
set_instance_parameter_value ddr2_bot board_maxCK_DQS_skew 0.01
set_instance_parameter_value ddr2_bot board_skew_ps 20
set_instance_parameter_value ddr2_bot t_DH 0.3
set_instance_parameter_value ddr2_bot ck_ckn_slew_rate 2.0
set_instance_parameter_value ddr2_bot isi_DQ 0.0
set_instance_parameter_value ddr2_bot t_IH_calculated 0.400
set_instance_parameter_value ddr2_bot t_DH_calculated 0.300
set_instance_parameter_value ddr2_bot t_DS 0.3

# connections
add_connection altpll_0.c0 cpu_ddr2_clock_crossing_bridge_0.s0_clk clock
add_connection altpll_0.c0 cpu_ddr2bot_clock_crossing_bridge_0.s0_clk clock
add_connection altpll_0.c0 cpu_ddr2top_clock_crossing_bridge_0.s0_clk clock
add_connection altpll_0.c0 ddr2_bot.refclk clock
add_connection altpll_0.c0 ddr2_top.refclk clock
add_connection altpll_0.c0 jtag_uart_0.clk clock
add_connection altpll_0.c0 nios2_qsys_0.clk clock
add_connection altpll_0.c0 stamptimer.clk clock
add_connection altpll_0.c0 sysid_qsys_0.clk clock
add_connection altpll_0.c0 systimer.clk clock
add_connection altpll_0.c1 ddr2.refclk clock
add_connection clk_0.clk altpll_0.inclk_interface clock
add_connection ddr2.sysclk cpu_ddr2_clock_crossing_bridge_0.m0_clk clock
add_connection ddr2_bot.sysclk cpu_ddr2bot_clock_crossing_bridge_0.m0_clk clock
add_connection ddr2_top.sysclk cpu_ddr2top_clock_crossing_bridge_0.m0_clk clock
add_connection nios2_qsys_0.jtag_debug_module_reset cpu_ddr2_clock_crossing_bridge_0.m0_reset reset
add_connection nios2_qsys_0.jtag_debug_module_reset cpu_ddr2_clock_crossing_bridge_0.s0_reset reset
add_connection nios2_qsys_0.jtag_debug_module_reset cpu_ddr2bot_clock_crossing_bridge_0.m0_reset reset
add_connection nios2_qsys_0.jtag_debug_module_reset cpu_ddr2bot_clock_crossing_bridge_0.s0_reset reset
add_connection nios2_qsys_0.jtag_debug_module_reset cpu_ddr2top_clock_crossing_bridge_0.m0_reset reset
add_connection nios2_qsys_0.jtag_debug_module_reset cpu_ddr2top_clock_crossing_bridge_0.s0_reset reset
add_connection nios2_qsys_0.jtag_debug_module_reset ddr2.global_reset_n reset
add_connection nios2_qsys_0.jtag_debug_module_reset ddr2.soft_reset_n reset
add_connection nios2_qsys_0.jtag_debug_module_reset ddr2_bot.global_reset_n reset
add_connection nios2_qsys_0.jtag_debug_module_reset ddr2_bot.soft_reset_n reset
add_connection nios2_qsys_0.jtag_debug_module_reset ddr2_top.global_reset_n reset
add_connection nios2_qsys_0.jtag_debug_module_reset ddr2_top.soft_reset_n reset
add_connection nios2_qsys_0.jtag_debug_module_reset jtag_uart_0.reset reset
add_connection nios2_qsys_0.jtag_debug_module_reset stamptimer.reset reset
add_connection nios2_qsys_0.jtag_debug_module_reset sysid_qsys_0.reset reset
add_connection nios2_qsys_0.jtag_debug_module_reset systimer.reset reset
add_connection reset_bridge_0.out_reset altpll_0.inclk_interface_reset reset
add_connection reset_bridge_0.out_reset clk_0.clk_in_reset reset
add_connection reset_bridge_0.out_reset cpu_ddr2_clock_crossing_bridge_0.m0_reset reset
add_connection reset_bridge_0.out_reset cpu_ddr2_clock_crossing_bridge_0.s0_reset reset
add_connection reset_bridge_0.out_reset cpu_ddr2bot_clock_crossing_bridge_0.m0_reset reset
add_connection reset_bridge_0.out_reset cpu_ddr2bot_clock_crossing_bridge_0.s0_reset reset
add_connection reset_bridge_0.out_reset cpu_ddr2top_clock_crossing_bridge_0.m0_reset reset
add_connection reset_bridge_0.out_reset cpu_ddr2top_clock_crossing_bridge_0.s0_reset reset
add_connection reset_bridge_0.out_reset ddr2.global_reset_n reset
add_connection reset_bridge_0.out_reset ddr2.soft_reset_n reset
add_connection reset_bridge_0.out_reset ddr2_bot.global_reset_n reset
add_connection reset_bridge_0.out_reset ddr2_bot.soft_reset_n reset
add_connection reset_bridge_0.out_reset ddr2_top.global_reset_n reset
add_connection reset_bridge_0.out_reset ddr2_top.soft_reset_n reset
add_connection reset_bridge_0.out_reset jtag_uart_0.reset reset
add_connection reset_bridge_0.out_reset nios2_qsys_0.reset_n reset
add_connection reset_bridge_0.out_reset stamptimer.reset reset
add_connection reset_bridge_0.out_reset sysid_qsys_0.reset reset
add_connection reset_bridge_0.out_reset systimer.reset reset
add_connection cpu_ddr2_clock_crossing_bridge_0.m0 ddr2.s1 avalon
set_connection_parameter_value cpu_ddr2_clock_crossing_bridge_0.m0/ddr2.s1 baseAddress 0x0000
add_connection cpu_ddr2bot_clock_crossing_bridge_0.m0 ddr2_bot.s1 avalon
set_connection_parameter_value cpu_ddr2bot_clock_crossing_bridge_0.m0/ddr2_bot.s1 baseAddress 0x0000
add_connection cpu_ddr2top_clock_crossing_bridge_0.m0 ddr2_top.s1 avalon
set_connection_parameter_value cpu_ddr2top_clock_crossing_bridge_0.m0/ddr2_top.s1 baseAddress 0x0000
add_connection nios2_qsys_0.data_master altpll_0.pll_slave avalon
set_connection_parameter_value nios2_qsys_0.data_master/altpll_0.pll_slave baseAddress 0x48001040
add_connection nios2_qsys_0.data_master cpu_ddr2_clock_crossing_bridge_0.s0 avalon
set_connection_parameter_value nios2_qsys_0.data_master/cpu_ddr2_clock_crossing_bridge_0.s0 baseAddress 0x44000000
add_connection nios2_qsys_0.data_master cpu_ddr2bot_clock_crossing_bridge_0.s0 avalon
set_connection_parameter_value nios2_qsys_0.data_master/cpu_ddr2bot_clock_crossing_bridge_0.s0 baseAddress 0x0000
add_connection nios2_qsys_0.data_master cpu_ddr2top_clock_crossing_bridge_0.s0 avalon
set_connection_parameter_value nios2_qsys_0.data_master/cpu_ddr2top_clock_crossing_bridge_0.s0 baseAddress 0x20000000
add_connection nios2_qsys_0.data_master jtag_uart_0.avalon_jtag_slave avalon
set_connection_parameter_value nios2_qsys_0.data_master/jtag_uart_0.avalon_jtag_slave baseAddress 0x48001050
add_connection nios2_qsys_0.data_master nios2_qsys_0.jtag_debug_module avalon
set_connection_parameter_value nios2_qsys_0.data_master/nios2_qsys_0.jtag_debug_module baseAddress 0x48000800
add_connection nios2_qsys_0.data_master stamptimer.s1 avalon
set_connection_parameter_value nios2_qsys_0.data_master/stamptimer.s1 baseAddress 0x48001000
add_connection nios2_qsys_0.data_master sysid_qsys_0.control_slave avalon
set_connection_parameter_value nios2_qsys_0.data_master/sysid_qsys_0.control_slave baseAddress 0x48001058
add_connection nios2_qsys_0.data_master systimer.s1 avalon
set_connection_parameter_value nios2_qsys_0.data_master/systimer.s1 baseAddress 0x48001020
add_connection nios2_qsys_0.instruction_master cpu_ddr2_clock_crossing_bridge_0.s0 avalon
set_connection_parameter_value nios2_qsys_0.instruction_master/cpu_ddr2_clock_crossing_bridge_0.s0 baseAddress 0x44000000
add_connection nios2_qsys_0.instruction_master nios2_qsys_0.jtag_debug_module avalon
set_connection_parameter_value nios2_qsys_0.instruction_master/nios2_qsys_0.jtag_debug_module baseAddress 0x48000800
add_connection nios2_qsys_0.d_irq jtag_uart_0.irq interrupt
set_connection_parameter_value nios2_qsys_0.d_irq/jtag_uart_0.irq irqNumber 1
add_connection nios2_qsys_0.d_irq stamptimer.irq interrupt
set_connection_parameter_value nios2_qsys_0.d_irq/stamptimer.irq irqNumber 0
add_connection nios2_qsys_0.d_irq systimer.irq interrupt
set_connection_parameter_value nios2_qsys_0.d_irq/systimer.irq irqNumber 2

# exported interfaces
add_interface clk clock sink
set_interface_property clk EXPORT_OF clk_0.clk_in
add_interface reset reset sink
set_interface_property reset EXPORT_OF reset_bridge_0.in_reset
add_interface ddr2_side conduit end
set_interface_property ddr2_side EXPORT_OF ddr2.memory
add_interface altpll_150m clock source
set_interface_property altpll_150m EXPORT_OF altpll_0.c2
add_interface ddr2_bot conduit end
set_interface_property ddr2_bot EXPORT_OF ddr2_bot.memory
add_interface ddr2_top conduit end
set_interface_property ddr2_top EXPORT_OF ddr2_top.memory

set_interconnect_requirement {$system} qsys_mm.clockCrossingAdapter HANDSHAKE
set_interconnect_requirement {$system} qsys_mm.maxAdditionalLatency 1

save_system ddr2_nios.qsys
